# Altium schematic sheet Connectors.SchDoc
size A4; SheetNumber: 3; SheetTotal: 4
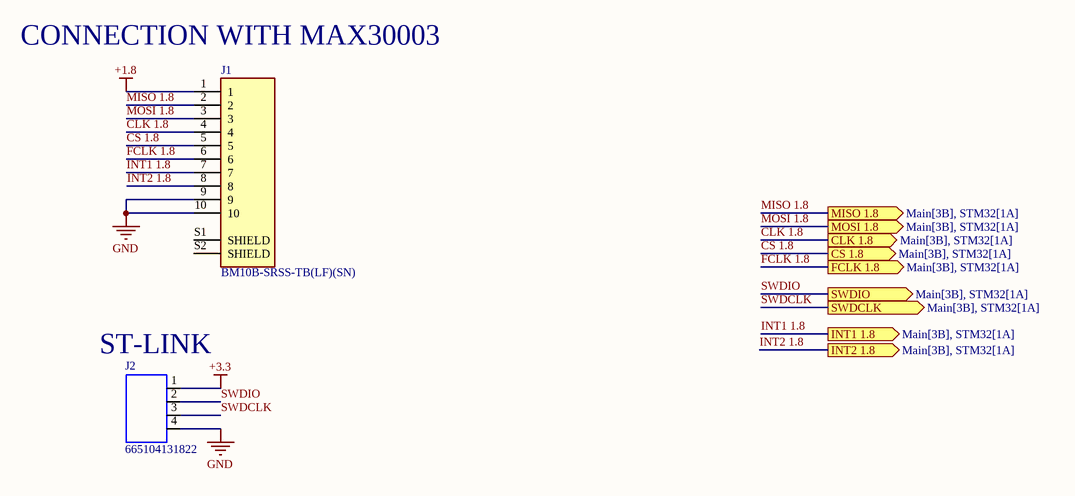
[diagram p0: Connectors.SchDoc]

## Parts
J1  BM10B-SRSS-TB(LF)(SN)  [JST_BM10B-SRSS-TB(LF)(SN)]
J2  665104131822  [665104131822]

## Ports
CLK 1.8 (out, see Main[3B], STM32[1A]), CS 1.8 (out, see Main[3B], STM32[1A]), FCLK 1.8 (out, see Main[3B], STM32[1A]), INT1 1.8 (out, see Main[3B], STM32[1A]), INT2 1.8 (out, see Main[3B], STM32[1A]), MISO 1.8 (out, see Main[3B], STM32[1A]), MOSI 1.8 (out, see Main[3B], STM32[1A]), SWDCLK (out, see Main[3B], STM32[1A]), SWDIO (out, see Main[3B], STM32[1A])

## Nets
+1.8: J1.1
+3.3: J2.1
GND: J1.9 J1.10 J2.4
CLK 1.8: J1.4 ; port CLK 1.8
CS 1.8: J1.5 ; port CS 1.8
FCLK 1.8: J1.6 ; port FCLK 1.8
INT1 1.8: J1.7 ; port INT1 1.8
INT2 1.8: J1.8 ; port INT2 1.8
MISO 1.8: J1.2 ; port MISO 1.8
MOSI 1.8: J1.3 ; port MOSI 1.8
SWDCLK: J2.3 ; port SWDCLK
SWDIO: J2.2 ; port SWDIO

Not connected (* = marked no-connect by the designer): J1 S1(SHIELD) S2(SHIELD)

## Notes on the sheet
- (near J1) CONNECTION WITH MAX30003
- (near J2) ST-LINK

## Library data of the parts
J1 = BM10B-SRSS-TB(LF)(SN): Connector Header Surface Mount 10 position 0.039 (1.00mm); MF: JST Sales; MP: BM10B-SRSS-TB(LF)(SN); Package: None; Check_prices: https://www.snapeda.com/parts/BM10B-SRSS-TB(LF)(SN)/JST+Sales+America+Inc./view-part/?ref=eda; SnapEDA_Link: https://www.snapeda.com/parts/BM10B-SRSS-TB(LF)(SN)/JST+Sales+America+Inc./view-part/?ref=snap; Availability: In Stock; Price: None; Value: *
J2 = 665104131822: Connector Header Surface Mount, Right Angle 4 position 0.039 (1.00mm); MF: Wurth Electronics; MP: 665104131822; Package: None; Price: None; Availability: Unavailable; SnapEDA_Link: https://www.snapeda.com/parts/665104131822/Wurth%20Electronics%20Inc./view-part/2395929/?ref=snap; Value: *